# EAGLE design galvo-schematic (EAGLE 8.6.3)
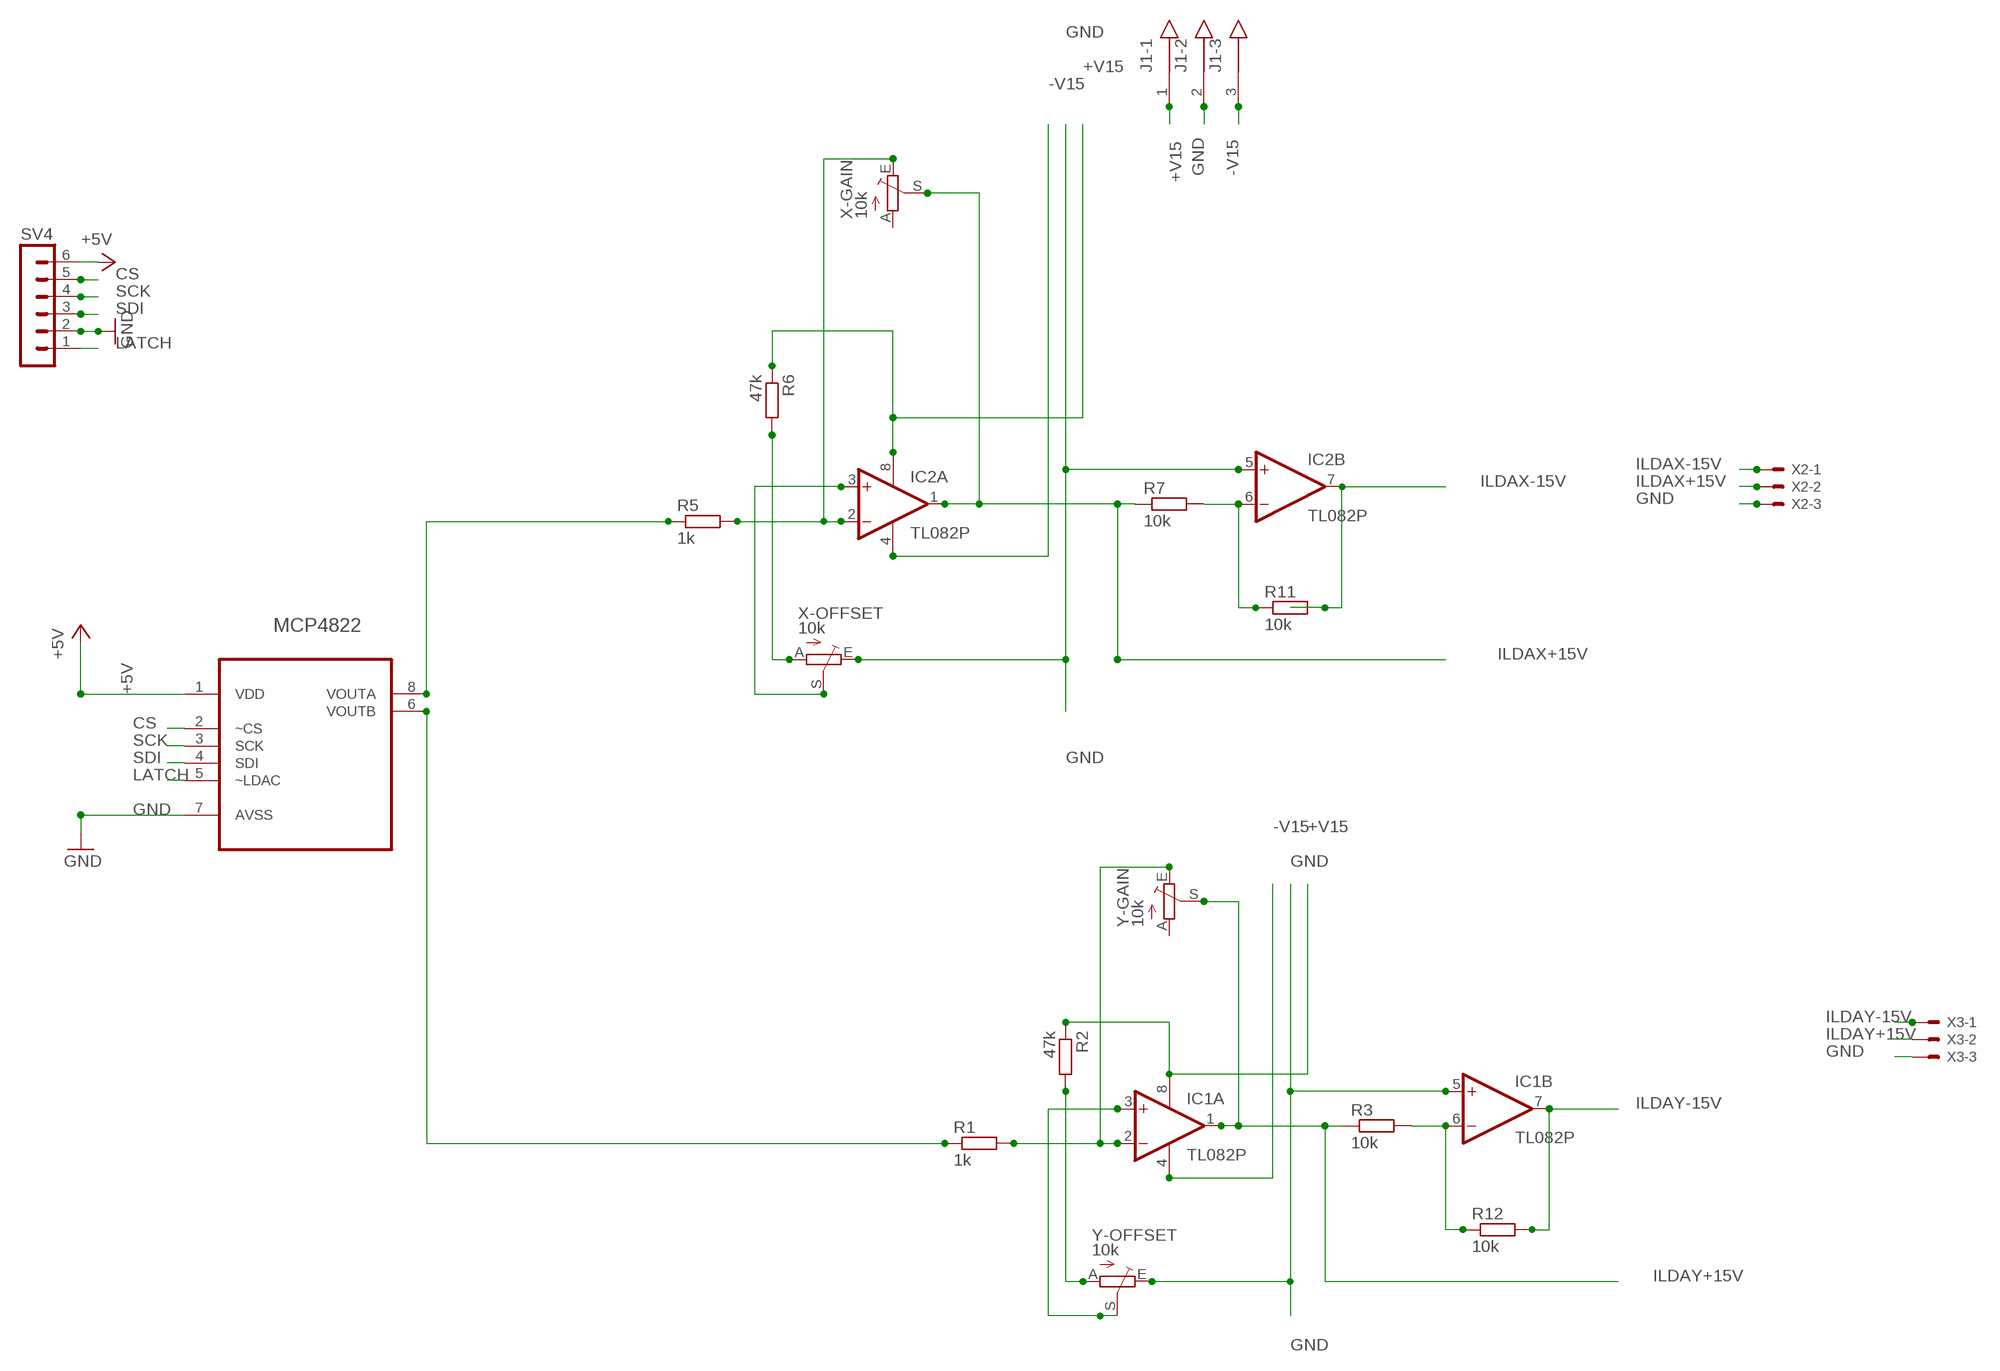
[diagram p0: schematic, sheet 1]

## Parts
IC1  TL082P  [DIL08]
IC2  TL082P  [DIL08]
J1  0022272031  [KK6410-2031_3-PIN]
MCP4822  MCP4822-E/P  [DIP254P762X432-8]
R1  1k  R-EU_0207/10  [0207/10]
R2  47k  R-EU_0207/10  [0207/10]
R3  10k  R-EU_0207/10  [0207/10]
R5  1k  R-EU_0207/10  [0207/10]
R6  47k  R-EU_0207/10  [0207/10]
R7  10k  R-EU_0207/10  [0207/10]
R11  10k  R-EU_0207/10  [0207/10]
R12  10k  R-EU_0207/10  [0207/10]
SV4  MA06-1  [MA06-1]
X2  JST-XH-03-PIN-ROUND-PAD  [JST-XH-03-PACKAGE-ROUND-PAD]
X3  JST-XH-03-PIN-ROUND-PAD  [JST-XH-03-PACKAGE-ROUND-PAD]
X-GAIN  10k  TRIM_EU-B25P  [B25P]
X-OFFSET  10k  TRIM_EU-B25P  [B25P]
Y-GAIN  10k  TRIM_EU-B25P  [B25P]
Y-OFFSET  10k  TRIM_EU-B25P  [B25P]

## Nets
+5V: MCP4822.1(VDD) SV4.6
+V15: IC1.8(P:V+) IC2.8(P:V+) J1.1 R2.1 R6.1
-V15: IC1.4(P:V-) IC2.4(P:V-) J1.3
CS: MCP4822.2(~CS) SV4.5
GND: IC1.5(B:+IN) IC2.5(B:+IN) J1.2 MCP4822.7(AVSS) SV4.2 X2.3 X3.3 X-OFFSET.E Y-OFFSET.E
ILDAX+15V: IC2.1(A:OUT) R7.1 X2.2 X-GAIN.S
ILDAX-15V: IC2.7(B:OUT) R11.2 X2.1
ILDAY+15V: IC1.1(A:OUT) R3.1 X3.2 Y-GAIN.S
ILDAY-15V: IC1.7(B:OUT) R12.2 X3.1
LATCH: MCP4822.5(~LDAC) SV4.1
N$1: IC1.6(B:-IN) R3.2 R12.1
N$3: R2.2 Y-OFFSET.A
N$4: IC2.6(B:-IN) R7.2 R11.1
N$5: IC1.3(A:+IN) Y-OFFSET.S
N$6: IC1.2(A:-IN) R1.2 Y-GAIN.E
N$8: MCP4822.6(VOUTB) R1.1
N$9: R6.2 X-OFFSET.A
N$10: IC2.2(A:-IN) R5.2 X-GAIN.E
N$12: IC2.3(A:+IN) X-OFFSET.S
N$15: MCP4822.8(VOUTA) R5.1
SCK: MCP4822.3(SCK) SV4.4
SDI: MCP4822.4(SDI) SV4.3
Unconnected: X-GAIN.A Y-GAIN.A

## Library data of the parts
IC1 IC2 = linear:TL082: OP AMP Data sheet <http://www.ti.com/lit/ds/symlink/tl084a . pdf>; DATA_SHEET: <a href="http://www.ti.com/lit/ds/symlink/tl084a.pdf"> Data sheet </a>
J1 = volks73-Molex:0022272031: KK® 254 Wire-to-Board Header, Vertical, with Friction Lock, 3 Circuits, Tin (Sn) Plating KK® Interconnect System Documentation Drawing <http://www.molex.com/pdm_docs/sd/022272031_sd.pdf> Product Specification <http://www.molex.com/pdm_docs/ps/PS-99020-0088.pdf>; COLOR: Natural; CONNECTOR_TYPE: Header, Unshrouded; CONTACT_FINISH: Tin; CONTACT_FINISH_THICKNESS: 100uin (2.54um); CONTACT_MATING_LENGTH: 0.295" (7.49mm); CONTACT_TYPE: Male Pin; DESCRIPTION: CONN HEADER 3POS .100 VERT TIN; DOCUMENTATION_LINK: <a href="http://www.molex.com/pdm_docs/sd/022272031_sd.pdf">Datasheet</a>; DOCUMENTATION_URL: http://www.molex.com/pdm_docs/sd/022272031_sd.pdf; FASTENING_TYPE: Friction Lock; FEATURES: -; MANUFACTURER: Molex Inc; MOUNTING_TYPE: Through Hole; NUMBER_OF_POSITIONS: 3; NUMBER_OF_POSITIONS_LOADED: All; NUMBER_OF_ROWS: 1; PART_NUMBER: 0022272031; PITCH: 0.100" (2.54mm); ROW_SPACING: -; SERIES: KK® 6410; SUPPLIER_ITEM_LINK: <a href="http://www.digikey.com/product-search/en?KeyWords=WM4112-ND&WT.z_header=search_go">Details</a>; SUPPLIER_ITEM_NUMBER: WM4112-ND; SUPPLIER_ITEM_URL: http://www.digikey.com/product-search/en?KeyWords=WM4112-ND&WT.z_header=search_go; SUPPLIER_LINK: <a href="http://www.digikey.com">Home Page</a>; SUPPLIER_NAME: Digi-Key; SUPPLIER_URL: http://www.digikey.com; TERMINATION: Solder
MCP4822 = Microchip_By_element14_Batch_1:MCP4822-E/P: DAC; MPN: MCP4822-E/P; OC_FARNELL: 1439413; OC_NEWARK: 11M1705; PACKAGE: DIP-8; SUPPLIER: Microchip
R1-R3 R5-R7 R11 R12 = resistor:R-EU_: RESISTOR, European symbol
SV4 = con-lstb:MA06-1: PIN HEADER; OC_FARNELL: unknown; OC_NEWARK: unknown
X2 X3 = Rembrandt Electronics - JST XH Connectors v1-0:JST-XH-03-PIN: JST XH Connector 2 Pin Wire to board connector. Pitch: 2,54 mm, (0.100") Number of pins: 3 Created by Rembrandt Electronics www.rembrandtelectronics.com
X-GAIN X-OFFSET Y-GAIN Y-OFFSET = pot:TRIM_EU-: POTENTIOMETER

## Board
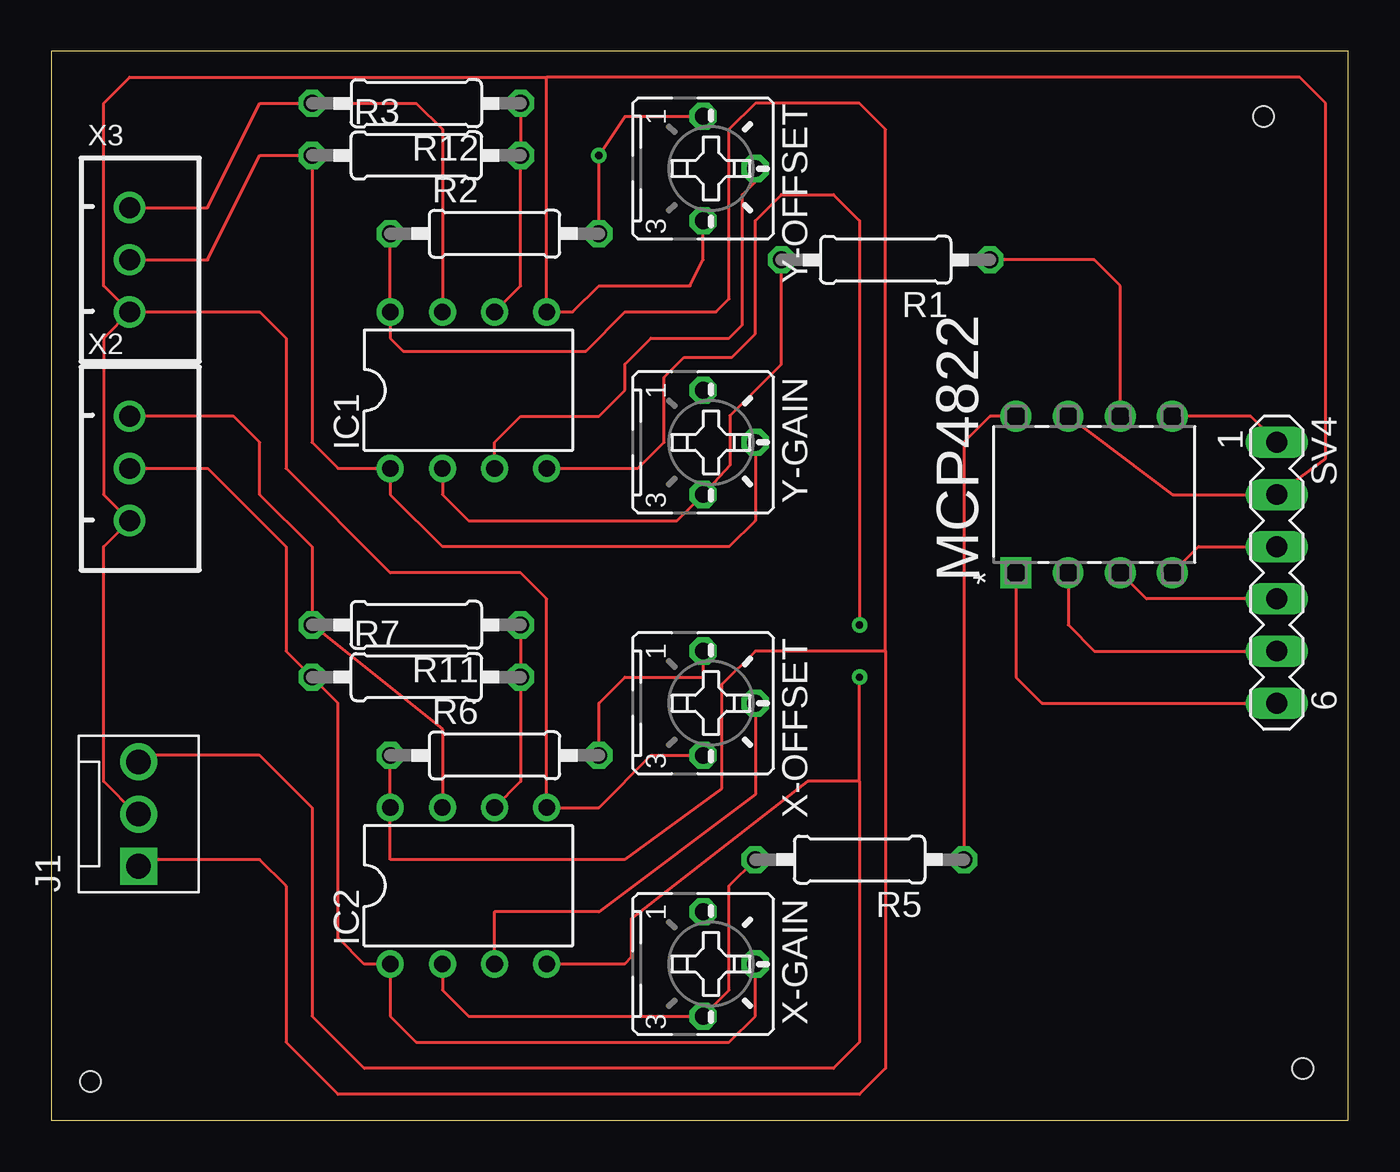
[diagram p1: board, top side]
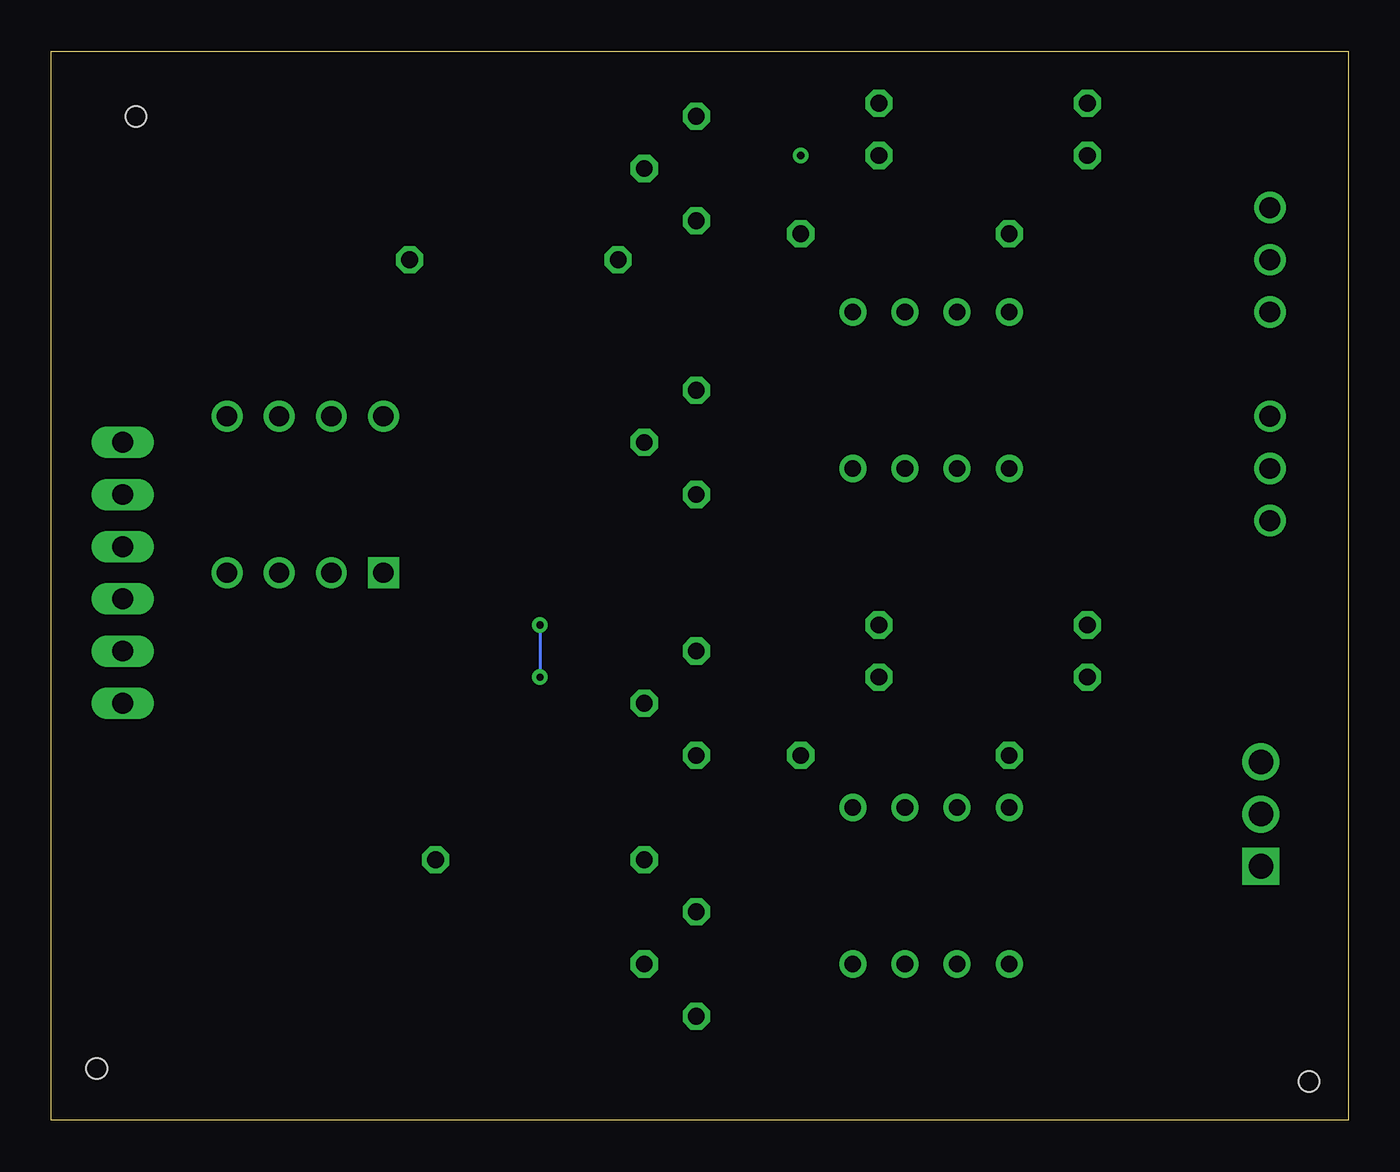
[diagram p2: board, bottom side, seen from below]

Size 63.17 x 52.06 mm. Coordinates in mm from the lower left corner, seen from the top.
Outline: 0,0 63.17,0 63.17,52.06 0,52.06 0,0
Copper layers (1*16): Top 0.035mm / dielectric 1.5mm / Bottom 0.035mm
Design rules "default": minimum track width 6mil, minimum drill 0.35mm, track to track 6mil, track to pad 6mil, pad to pad 6mil, via to via 6mil, smd to smd 6mil, copper to edge 40mil, drill to drill 6mil, minimum pad ring 10mil, minimum via ring 8mil, stop-mask expansion 4mil, vias tented up to drill 0mil, thermal gap 10mil
Holes 1 mm at 60.96,2.54 59.05,48.89 1.91,1.91

### Footprints (pad centres in the part's own frame; a part is rotated, then mirrored left to right if it is on the bottom)
DIL08 = drill 0.813 pad 1.27: 1 -3.81,-3.81; 2 -1.27,-3.81; 3 1.27,-3.81; 4 3.81,-3.81; 5 3.81,3.81; 6 1.27,3.81; 7 -1.27,3.81; 8 -3.81,3.81
KK6410-2031_3-PIN = drill 1.2 square: 1 -2.54,0 | drill 1.2: 2 0,0; 3 2.54,0
DIP254P762X432-8 = drill 0.991 square: 1 -7.62,7.62 | drill 0.991: 2 -7.62,5.08; 3 -7.62,2.54; 4 -7.62,0; 5 0,0; 6 0,2.54; 7 0,5.08; 8 0,7.62
0207/10 = drill 0.813 octagon: 1 -5.08,0; 2 5.08,0
MA06-1 = drill 1.016 long: 1 -6.35,0; 2 -3.81,0; 3 -1.27,0; 4 1.27,0; 5 3.81,0; 6 6.35,0
JST-XH-03-PACKAGE-ROUND-PAD = drill 1.016: 1 -2.54,0; 2 0,0; 3 2.54,0
B25P = drill 0.813 octagon: A -2.54,0; E 2.54,0; S 0,2.54

### Placement (x,y rotation side)
IC1  20.32,35.56 0 top
IC2  20.32,11.43 0 top
J1  4.25,14.92 90 top
MCP4822  54.61,34.29 90 top
R1  40.64,41.91 180 top
R2  21.59,43.18 0 top
R3  17.78,46.99 0 top
R5  39.37,12.7 180 top
R6  21.59,17.78 0 top
R7  17.78,21.59 0 top
R11  17.78,24.13 180 top
R12  17.78,49.53 180 top
SV4  59.69,26.67 270 top
X2  3.81,31.75 270 top
X3  3.81,41.91 270 top
X-GAIN  31.75,7.62 270 top
X-OFFSET  31.75,20.32 270 top
Y-GAIN  31.75,33.02 270 top
Y-OFFSET  31.75,46.35 270 top

### Tracks (layer width: path | path; a pad name or v marks a point on that pad's centre or on a via)
+5V
  Top 0.152: SV4.6 48.26,20.32 46.99,21.59 MCP4822.1
+V15
  Top 0.152: R6.1 IC2.8 16.51,12.7 27.94,12.7 27.94,12.71 32.64,16.14 32.64,21.21 34.29,22.86 40.64,22.86 | 40.64,22.86 40.64,48.26 39.37,49.53 34.29,49.53 33.02,48.26 33.02,40.01 32.38,39.37 27.94,39.37 26.04,37.46 17.14,37.46 16.51,38.1 IC1.8 R2.1 | J1.1 4.76,12.38 5.08,12.7 10.16,12.7 11.43,11.43 11.43,3.81 13.97,1.27 39.37,1.27 40.64,2.54 40.64,22.86
-V15  (via drill 0.35)
  Top 0.152: 39.37,16.51 36.83,16.51 28.25,9.83 28.25,7.94 27.93,7.62 IC2.4 | IC1.4 28.57,31.75 29.84,33.02 29.84,36.18 30.82,37.16 33.15,37.16 34.29,38.3 34.29,43.81 35.56,45.09 38.1,45.09 39.37,43.81 v39.37,24.13 | 39.37,16.51 v39.37,21.59 | J1.3 4.57,17.78 10.16,17.78 12.7,15.24 12.7,5.08 15.24,2.54 38.1,2.54 39.37,3.81 39.37,16.51
  Bottom 0.152: v39.37,24.13 v39.37,21.59
CS
  Top 0.152: MCP4822.2 49.53,24.13 50.8,22.86 SV4.5
GND
  Top 0.152: X-OFFSET.E 29.21,17.78 26.67,15.24 IC2.5 24.13,25.4 22.86,26.67 16.51,26.67 11.43,31.75 11.43,38.1 10.16,39.37 X3.3 | 24.13,50.8 3.81,50.8 2.54,49.53 2.54,40.64 X3.3 | 24.13,50.8 60.81,50.8 62.08,49.53 62.08,32.23 SV4.2 54.61,30.48 MCP4822.7 | X2.3 2.54,27.94 2.54,16.51 4.13,14.92 J1.2 | X2.3 3.81,29.08 | X3.3 2.54,38.1 2.54,30.48 X2.3 | 24.13,50.8 IC1.5 25.4,39.37 26.67,40.64 31.11,40.64 31.75,41.91 Y-OFFSET.E
ILDAX+15V
  Top 0.152: X-GAIN.S 34.29,5.08 33.02,3.81 17.78,3.81 16.51,5.08 IC2.1 15.24,7.62 13.97,8.89 13.97,20.32 R7.1 11.43,22.86 11.43,27.94 7.62,31.75 X2.2
ILDAX-15V
  Top 0.152: X2.1 8.89,34.29 10.16,33.02 10.16,30.48 12.7,27.94 R11.2 19.05,19.05 IC2.7
ILDAY+15V
  Top 0.152: X3.2 7.62,41.91 10.16,46.99 R3.1 12.7,33.02 13.97,31.75 IC1.1 16.51,30.48 19.05,27.94 33.02,27.94 34.29,29.21 Y-GAIN.S
ILDAY-15V
  Top 0.152: X3.1 7.62,44.45 10.16,49.53 R12.2 17.78,49.53 19.05,48.26 IC1.7
LATCH
  Top 0.152: SV4.1 58.42,34.29 MCP4822.5
N$1
  Top 0.152: R12.1 R3.2 22.86,40.64 IC1.6
N$3  (via drill 0.35)
  Top 0.152: Y-OFFSET.A 27.94,48.89 v26.67,46.99 R2.2
N$4
  Top 0.152: R11.1 R7.2 22.86,16.51 IC2.6
N$5
  Top 0.152: Y-OFFSET.S 34.29,45.72 33.66,45.09 33.66,38.73 33.02,38.1 29.21,38.1 27.94,36.83 27.94,35.56 26.67,34.29 22.86,34.29 21.59,33.02 IC1.3
N$6
  Top 0.152: IC1.2 19.05,30.48 20.32,29.21 30.48,29.21 Y-GAIN.E 33.06,31.9 33.06,34.33 35.56,36.83 R1.2
N$8
  Top 0.152: MCP4822.6 52.07,40.64 50.8,41.91 R1.1
N$9
  Top 0.152: X-OFFSET.A 31.75,21.59 27.94,21.59 26.67,20.32 R6.2
N$10
  Top 0.152: IC2.2 19.05,6.35 20.32,5.08 X-GAIN.E 33.02,6.35 33.02,11.43 R5.2
N$12
  Top 0.152: IC2.3 21.59,10.16 26.67,10.16 34.29,15.88 X-OFFSET.S
N$15
  Top 0.152: MCP4822.8 45.72,34.29 44.45,33.02 R5.1
SCK
  Top 0.152: SV4.4 53.34,25.4 MCP4822.3
SDI
  Top 0.152: MCP4822.4 55.88,27.94 SV4.3